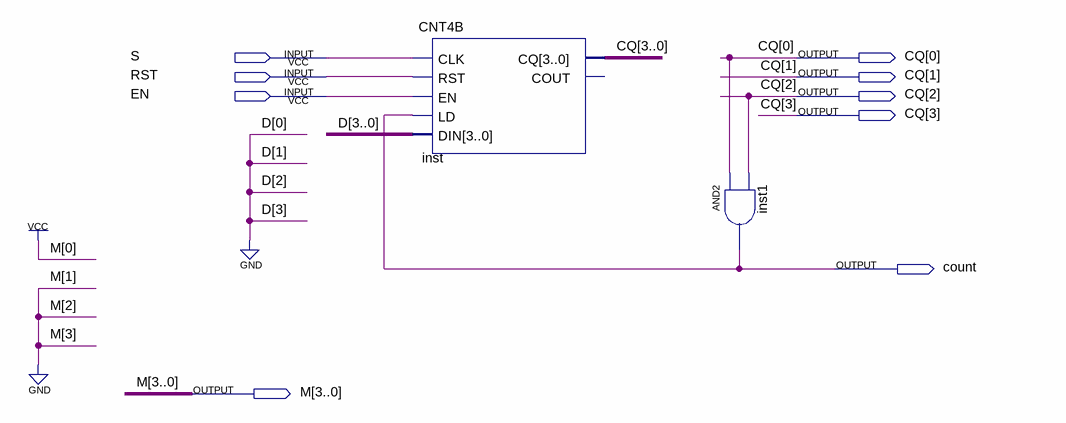
[diagram p0: schematic sheet]
// Quartus schematic shiyan_2.bdf as structural Verilog: 2 symbols, 9 pins
module shiyan_2 (
  input  S,
  input  RST,
  input  EN,
  output [3:0] CQ,
  output count,
  output [3:0] M
);

  CNT4B inst (.CLK(S), .RST(RST), .EN(EN), .LD(count), .DIN(4'b0000), .CQ(CQ));  // open: COUT
  and inst1 (count, CQ[0], CQ[2]);

  assign M = 4'b0001;
endmodule
